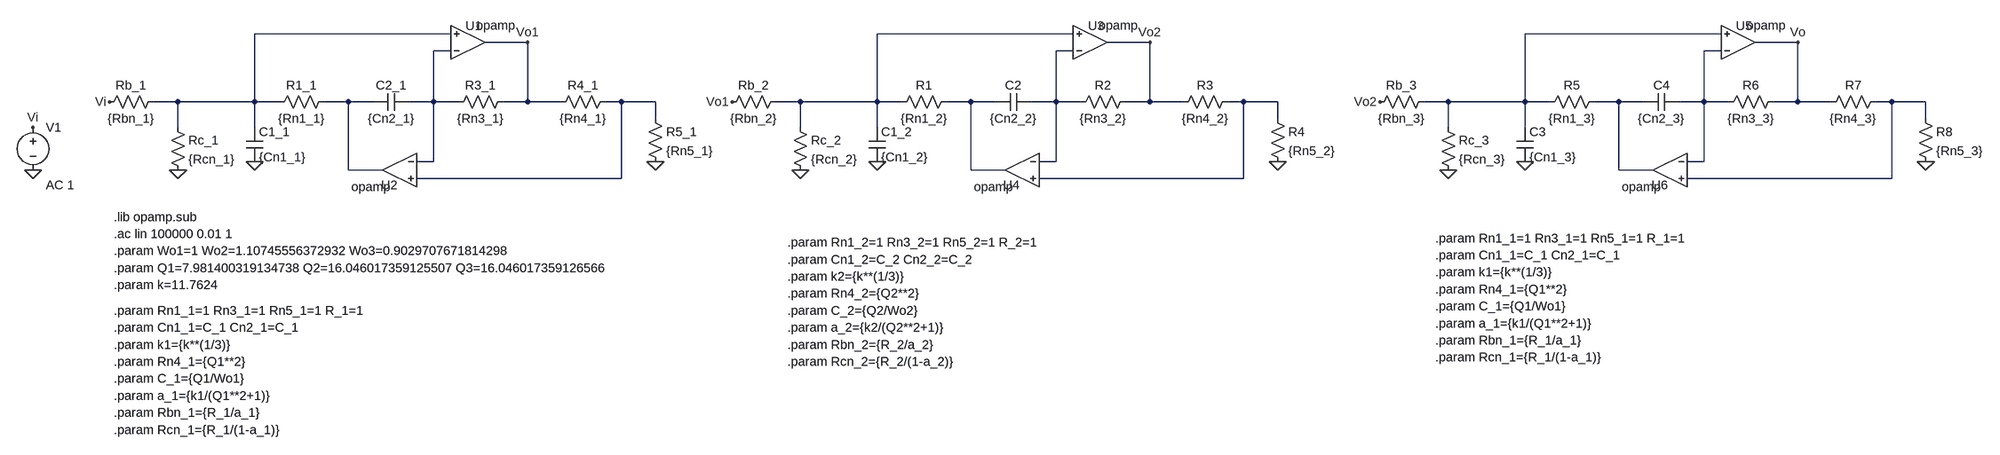
[diagram p0: schematic simulación circuital red activa.asc]
simulación circuital red activa.asc, the LTspice schematic file:
Version 4
SHEET 1 3072 784
WIRE 176 16 -192 16
WIRE 1344 16 976 16
WIRE 2560 16 2192 16
WIRE 320 32 240 32
WIRE 1488 32 1408 32
WIRE 2704 32 2624 32
WIRE 176 48 144 48
WIRE 1344 48 1312 48
WIRE 2560 48 2528 48
WIRE -336 144 -384 144
WIRE -192 144 -192 16
WIRE -192 144 -336 144
WIRE -144 144 -192 144
WIRE -16 144 -64 144
WIRE 32 144 -16 144
WIRE 144 144 144 48
WIRE 144 144 96 144
WIRE 192 144 144 144
WIRE 320 144 320 32
WIRE 320 144 272 144
WIRE 384 144 320 144
WIRE 496 144 464 144
WIRE 560 144 496 144
WIRE 832 144 784 144
WIRE 976 144 976 16
WIRE 976 144 832 144
WIRE 1024 144 976 144
WIRE 1152 144 1104 144
WIRE 1200 144 1152 144
WIRE 1312 144 1312 48
WIRE 1312 144 1264 144
WIRE 1360 144 1312 144
WIRE 1488 144 1488 32
WIRE 1488 144 1440 144
WIRE 1552 144 1488 144
WIRE 1664 144 1632 144
WIRE 1728 144 1664 144
WIRE 2048 144 2000 144
WIRE 2192 144 2192 16
WIRE 2192 144 2048 144
WIRE 2240 144 2192 144
WIRE 2368 144 2320 144
WIRE 2416 144 2368 144
WIRE 2528 144 2528 48
WIRE 2528 144 2480 144
WIRE 2576 144 2528 144
WIRE 2704 144 2704 32
WIRE 2704 144 2656 144
WIRE 2768 144 2704 144
WIRE 2880 144 2848 144
WIRE 2944 144 2880 144
WIRE 560 176 560 144
WIRE 1728 176 1728 144
WIRE 2944 176 2944 144
WIRE -336 192 -336 144
WIRE -192 192 -192 144
WIRE 832 192 832 144
WIRE 976 192 976 144
WIRE 2048 192 2048 144
WIRE 2192 192 2192 144
WIRE 144 256 144 144
WIRE 144 256 112 256
WIRE 1312 256 1312 144
WIRE 1312 256 1280 256
WIRE 2528 256 2528 144
WIRE 2528 256 2496 256
WIRE -16 272 -16 144
WIRE 48 272 -16 272
WIRE 1152 272 1152 144
WIRE 1216 272 1152 272
WIRE 2368 272 2368 144
WIRE 2432 272 2368 272
WIRE 496 288 496 144
WIRE 496 288 112 288
WIRE 1664 288 1664 144
WIRE 1664 288 1280 288
WIRE 2880 288 2880 144
WIRE 2880 288 2496 288
FLAG 560 256 0
FLAG -192 256 0
FLAG -336 272 0
FLAG -464 144 Vi
FLAG 320 32 Vo1
FLAG -608 272 0
FLAG -608 192 Vi
FLAG 1728 256 0
FLAG 976 256 0
FLAG 832 272 0
FLAG 1488 32 Vo2
FLAG 2944 256 0
FLAG 2192 256 0
FLAG 2048 272 0
FLAG 2704 32 Vo
FLAG 704 144 Vo1
FLAG 1920 144 Vo2
SYMBOL OpAmps\\opamp 208 96 M180
WINDOW 0 -4 95 Left 2
SYMATTR InstName U1
SYMBOL OpAmps\\opamp 80 208 M0
WINDOW 0 4 92 Left 2
SYMATTR InstName U2
SYMBOL res -48 128 R90
WINDOW 0 0 56 VBottom 2
WINDOW 3 32 56 VTop 2
SYMATTR InstName R1_1
SYMATTR Value {Rn1_1}
SYMBOL cap -208 192 R0
SYMATTR InstName C1_1
SYMATTR Value {Cn1_1}
SYMBOL cap 96 128 R90
WINDOW 0 0 32 VBottom 2
WINDOW 3 32 32 VTop 2
SYMATTR InstName C2_1
SYMATTR Value {Cn2_1}
SYMBOL res 288 128 R90
WINDOW 0 0 56 VBottom 2
WINDOW 3 32 56 VTop 2
SYMATTR InstName R3_1
SYMATTR Value {Rn3_1}
SYMBOL res 480 128 R90
WINDOW 0 0 56 VBottom 2
WINDOW 3 32 56 VTop 2
SYMATTR InstName R4_1
SYMATTR Value {Rn4_1}
SYMBOL res 544 160 R0
SYMATTR InstName R5_1
SYMATTR Value {Rn5_1}
SYMBOL res -352 176 R0
SYMATTR InstName Rc_1
SYMATTR Value {Rcn_1}
SYMBOL res -368 128 R90
WINDOW 0 0 56 VBottom 2
WINDOW 3 32 56 VTop 2
SYMATTR InstName Rb_1
SYMATTR Value {Rbn_1}
SYMBOL voltage -608 176 R0
WINDOW 123 24 124 Left 2
WINDOW 39 0 0 Left 0
SYMATTR InstName V1
SYMATTR Value ""
SYMATTR Value2 AC 1
SYMBOL OpAmps\\opamp 1376 96 M180
WINDOW 0 -4 95 Left 2
SYMATTR InstName U3
SYMBOL OpAmps\\opamp 1248 208 M0
WINDOW 0 4 92 Left 2
SYMATTR InstName U4
SYMBOL res 1120 128 R90
WINDOW 0 0 56 VBottom 2
WINDOW 3 32 56 VTop 2
SYMATTR InstName R1
SYMATTR Value {Rn1_2}
SYMBOL cap 960 192 R0
SYMATTR InstName C1_2
SYMATTR Value {Cn1_2}
SYMBOL cap 1264 128 R90
WINDOW 0 0 32 VBottom 2
WINDOW 3 32 32 VTop 2
SYMATTR InstName C2
SYMATTR Value {Cn2_2}
SYMBOL res 1456 128 R90
WINDOW 0 0 56 VBottom 2
WINDOW 3 32 56 VTop 2
SYMATTR InstName R2
SYMATTR Value {Rn3_2}
SYMBOL res 1648 128 R90
WINDOW 0 0 56 VBottom 2
WINDOW 3 32 56 VTop 2
SYMATTR InstName R3
SYMATTR Value {Rn4_2}
SYMBOL res 1712 160 R0
SYMATTR InstName R4
SYMATTR Value {Rn5_2}
SYMBOL res 816 176 R0
SYMATTR InstName Rc_2
SYMATTR Value {Rcn_2}
SYMBOL res 800 128 R90
WINDOW 0 0 56 VBottom 2
WINDOW 3 32 56 VTop 2
SYMATTR InstName Rb_2
SYMATTR Value {Rbn_2}
SYMBOL OpAmps\\opamp 2592 96 M180
WINDOW 0 -4 95 Left 2
SYMATTR InstName U5
SYMBOL OpAmps\\opamp 2464 208 M0
WINDOW 0 4 92 Left 2
SYMATTR InstName U6
SYMBOL res 2336 128 R90
WINDOW 0 0 56 VBottom 2
WINDOW 3 32 56 VTop 2
SYMATTR InstName R5
SYMATTR Value {Rn1_3}
SYMBOL cap 2176 192 R0
SYMATTR InstName C3
SYMATTR Value {Cn1_3}
SYMBOL cap 2480 128 R90
WINDOW 0 0 32 VBottom 2
WINDOW 3 32 32 VTop 2
SYMATTR InstName C4
SYMATTR Value {Cn2_3}
SYMBOL res 2672 128 R90
WINDOW 0 0 56 VBottom 2
WINDOW 3 32 56 VTop 2
SYMATTR InstName R6
SYMATTR Value {Rn3_3}
SYMBOL res 2864 128 R90
WINDOW 0 0 56 VBottom 2
WINDOW 3 32 56 VTop 2
SYMATTR InstName R7
SYMATTR Value {Rn4_3}
SYMBOL res 2928 160 R0
SYMATTR InstName R8
SYMATTR Value {Rn5_3}
SYMBOL res 2032 176 R0
SYMATTR InstName Rc_3
SYMATTR Value {Rcn_3}
SYMBOL res 2016 128 R90
WINDOW 0 0 56 VBottom 2
WINDOW 3 32 56 VTop 2
SYMATTR InstName Rb_3
SYMATTR Value {Rbn_3}
TEXT -456 360 Left 2 !.lib opamp.sub
TEXT -456 392 Left 2 !.ac lin 100000 0.01 1
TEXT -456 424 Left 2 !.param Wo1=1 Wo2=1.10745556372932 Wo3=0.9029707671814298
TEXT -456 456 Left 2 !.param Q1=7.981400319134738 Q2=16.046017359125507 Q3=16.046017359126566
TEXT -456 536 Left 2 !.param Rn1_1=1 Rn3_1=1 Rn5_1=1 R_1=1
TEXT -456 568 Left 2 !.param Cn1_1=C_1 Cn2_1=C_1
TEXT -456 632 Left 2 !.param Rn4_1={Q1**2}
TEXT -456 664 Left 2 !.param C_1={Q1/Wo1}
TEXT -456 696 Left 2 !.param a_1={k1/(Q1**2+1)}
TEXT -456 728 Left 2 !.param Rbn_1={R_1/a_1}
TEXT -456 760 Left 2 !.param Rcn_1={R_1/(1-a_1)}
TEXT -456 600 Left 2 !.param k1={k**(1/3)}
TEXT -456 488 Left 2 !.param k=11.7624
TEXT 808 408 Left 2 !.param Rn1_2=1 Rn3_2=1 Rn5_2=1 R_2=1
TEXT 808 440 Left 2 !.param Cn1_2=C_2 Cn2_2=C_2
TEXT 808 504 Left 2 !.param Rn4_2={Q2**2}
TEXT 808 536 Left 2 !.param C_2={Q2/Wo2}
TEXT 808 568 Left 2 !.param a_2={k2/(Q2**2+1)}
TEXT 808 600 Left 2 !.param Rbn_2={R_2/a_2}
TEXT 808 632 Left 2 !.param Rcn_2={R_2/(1-a_2)}
TEXT 808 472 Left 2 !.param k2={k**(1/3)}
TEXT 2024 400 Left 2 !.param Rn1_1=1 Rn3_1=1 Rn5_1=1 R_1=1
TEXT 2024 432 Left 2 !.param Cn1_1=C_1 Cn2_1=C_1
TEXT 2024 496 Left 2 !.param Rn4_1={Q1**2}
TEXT 2024 528 Left 2 !.param C_1={Q1/Wo1}
TEXT 2024 560 Left 2 !.param a_1={k1/(Q1**2+1)}
TEXT 2024 592 Left 2 !.param Rbn_1={R_1/a_1}
TEXT 2024 624 Left 2 !.param Rcn_1={R_1/(1-a_1)}
TEXT 2024 464 Left 2 !.param k1={k**(1/3)}

The netlist it stands for:
* simulación circuital red activa.asc
XU1 N004 N001 Vo1 opamp Aol=100K GBW=10Meg  ; pins invin noninvin out
XU2 N004 N008 N007 opamp Aol=100K GBW=10Meg  ; pins invin noninvin out
R1_1 N007 N001 {Rn1_1}
C1_1 N001 0 {Cn1_1}
C2_1 N004 N007 {Cn2_1}
R3_1 Vo1 N004 {Rn3_1}
R4_1 N008 Vo1 {Rn4_1}
R5_1 N008 0 {Rn5_1}
Rc_1 N001 0 {Rcn_1}
Rb_1 N001 Vi {Rbn_1}
V1 Vi 0 AC 1
XU3 N005 N002 Vo2 opamp Aol=100K GBW=10Meg  ; pins invin noninvin out
XU4 N005 N010 N009 opamp Aol=100K GBW=10Meg  ; pins invin noninvin out
R1 N009 N002 {Rn1_2}
C1_2 N002 0 {Cn1_2}
C2 N005 N009 {Cn2_2}
R2 Vo2 N005 {Rn3_2}
R3 N010 Vo2 {Rn4_2}
R4 N010 0 {Rn5_2}
Rc_2 N002 0 {Rcn_2}
Rb_2 N002 Vo1 {Rbn_2}
XU5 N006 N003 Vo opamp Aol=100K GBW=10Meg  ; pins invin noninvin out
XU6 N006 N012 N011 opamp Aol=100K GBW=10Meg  ; pins invin noninvin out
R5 N011 N003 {Rn1_3}
C3 N003 0 {Cn1_3}
C4 N006 N011 {Cn2_3}
R6 Vo N006 {Rn3_3}
R7 N012 Vo {Rn4_3}
R8 N012 0 {Rn5_3}
Rc_3 N003 0 {Rcn_3}
Rb_3 N003 Vo2 {Rbn_3}
.lib opamp.sub
.ac lin 100000 0.01 1
.param Wo1=1 Wo2=1.10745556372932 Wo3=0.9029707671814298
.param Q1=7.981400319134738 Q2=16.046017359125507 Q3=16.046017359126566
.param Rn1_1=1 Rn3_1=1 Rn5_1=1 R_1=1
.param Cn1_1=C_1 Cn2_1=C_1
.param Rn4_1={Q1**2}
.param C_1={Q1/Wo1}
.param a_1={k1/(Q1**2+1)}
.param Rbn_1={R_1/a_1}
.param Rcn_1={R_1/(1-a_1)}
.param k1={k**(1/3)}
.param k=11.7624
.param Rn1_2=1 Rn3_2=1 Rn5_2=1 R_2=1
.param Cn1_2=C_2 Cn2_2=C_2
.param Rn4_2={Q2**2}
.param C_2={Q2/Wo2}
.param a_2={k2/(Q2**2+1)}
.param Rbn_2={R_2/a_2}
.param Rcn_2={R_2/(1-a_2)}
.param k2={k**(1/3)}
.param Rn1_1=1 Rn3_1=1 Rn5_1=1 R_1=1
.param Cn1_1=C_1 Cn2_1=C_1
.param Rn4_1={Q1**2}
.param C_1={Q1/Wo1}
.param a_1={k1/(Q1**2+1)}
.param Rbn_1={R_1/a_1}
.param Rcn_1={R_1/(1-a_1)}
.param k1={k**(1/3)}
.backanno
.end